# Altium schematic sheet Pull_test.SchDoc
size A3; Date: 2019年10月4日; Author: XJJ; DrawnBy: XJJ; Engineer: XJJ
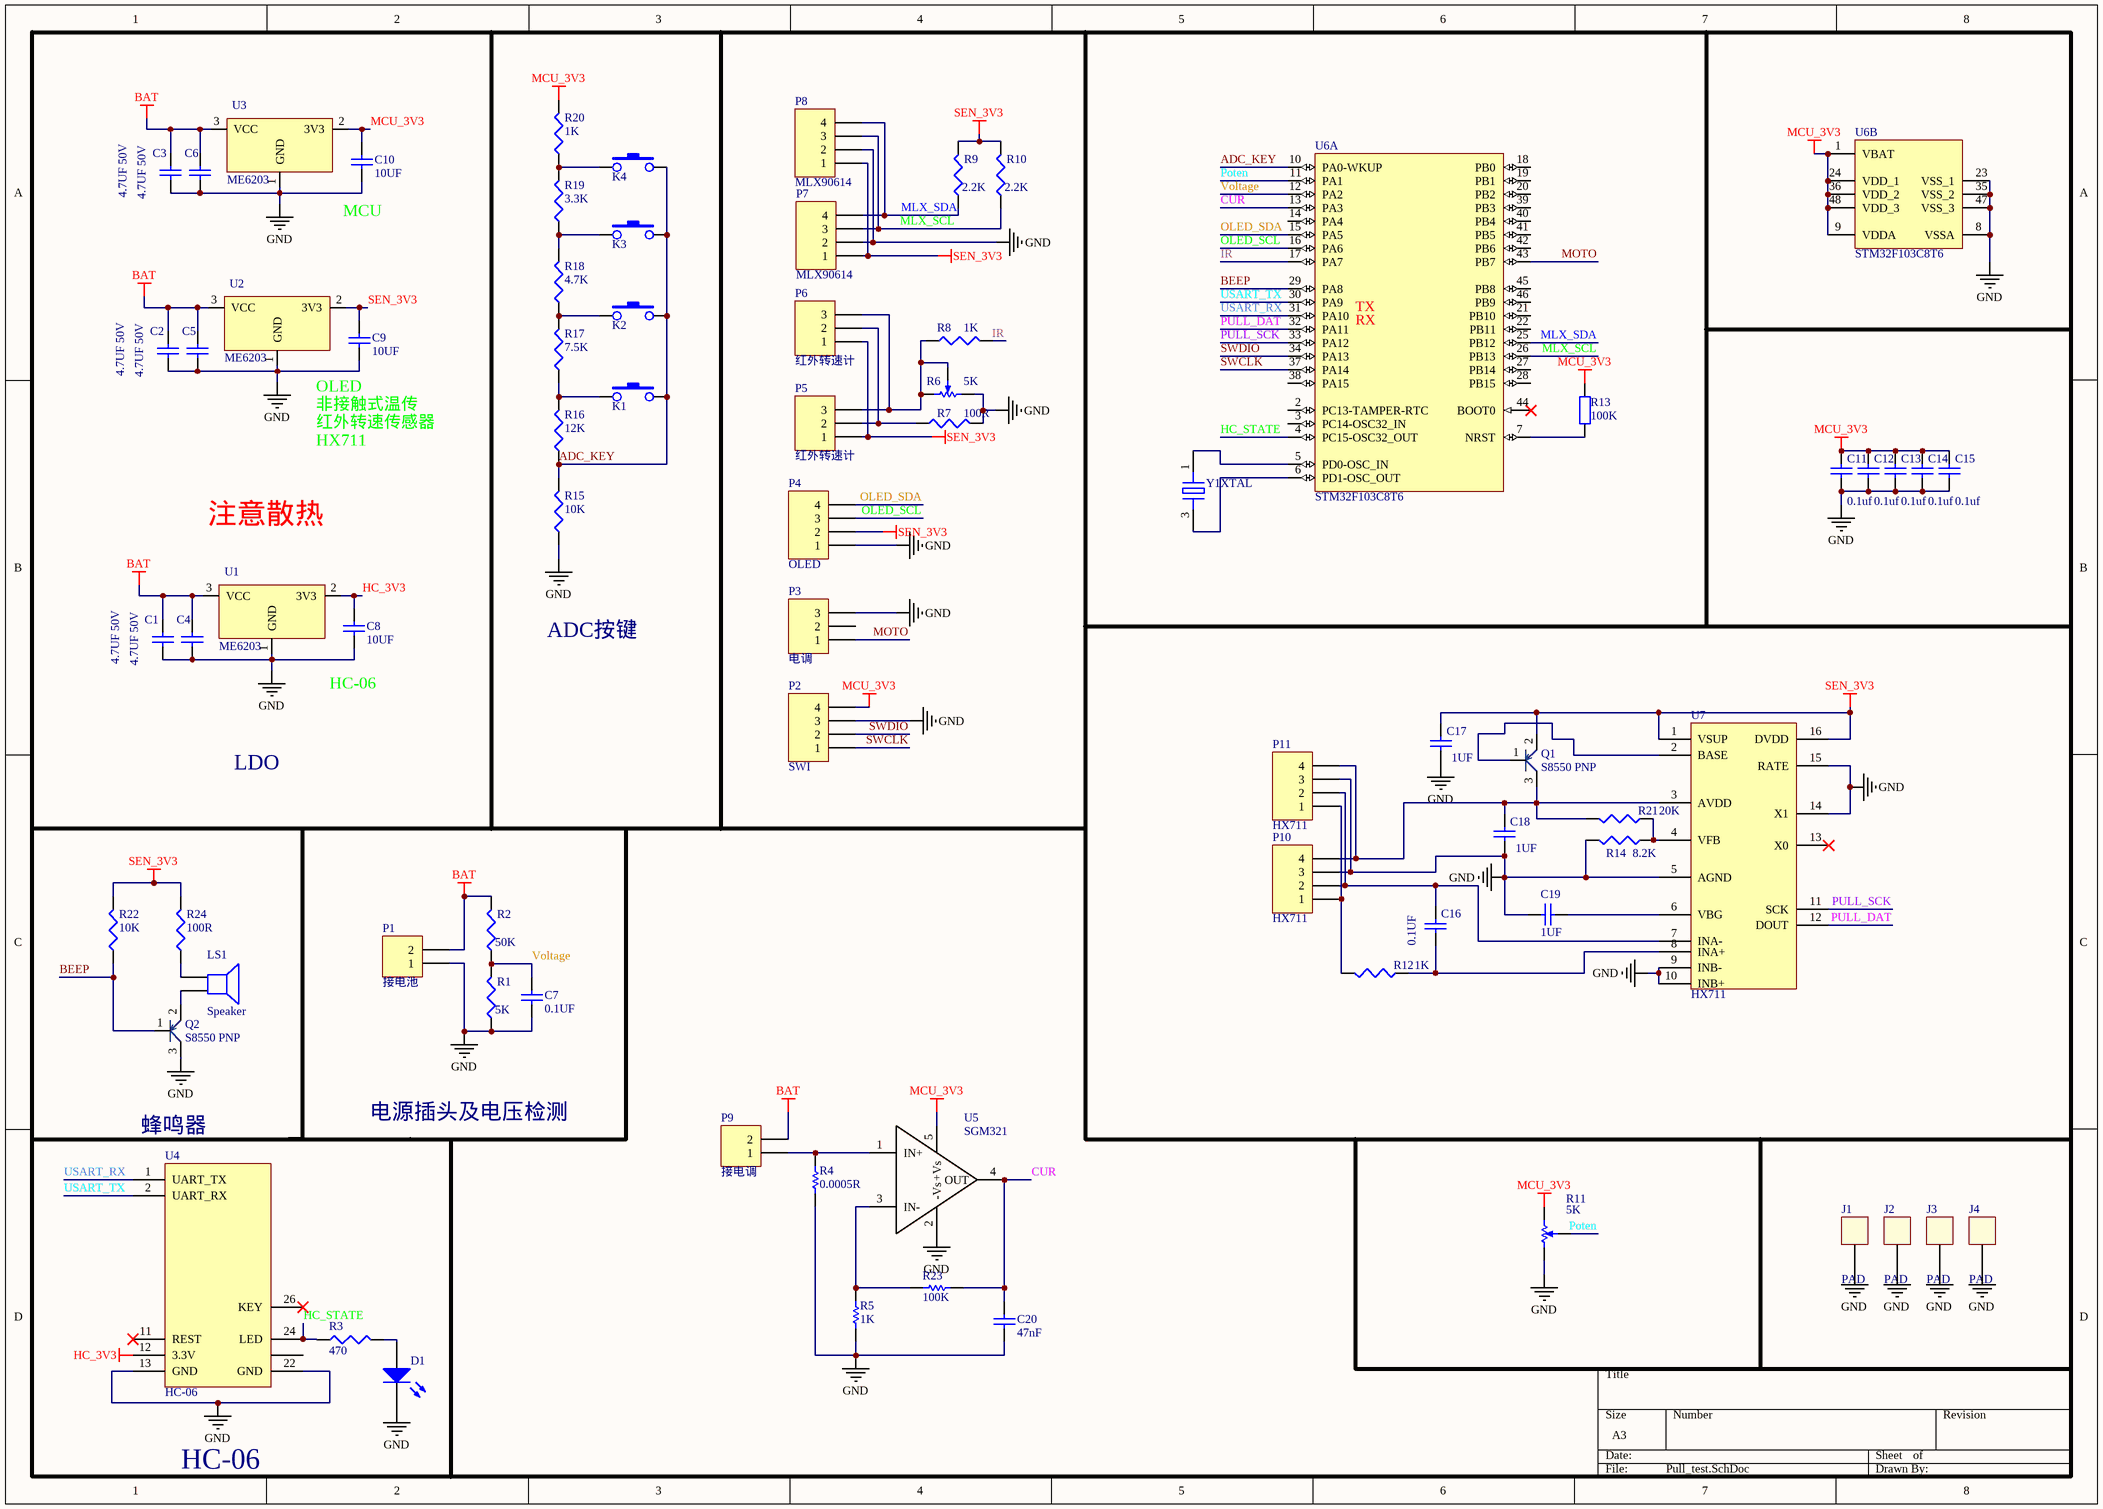
[diagram p0: Pull_test.SchDoc]

## Parts
C1  4.7UF 50V  [0805C]
C2  4.7UF 50V  [0805C]
C3  4.7UF 50V  [0805C]
C4  4.7UF 50V  [0805C]
C5  4.7UF 50V  [0805C]
C6  4.7UF 50V  [0805C]
C7  0.1UF  [0603]
C8  10UF  [0603]
C9  10UF  [0603]
C10  10UF  [0603]
C11  0.1uf  [0603]
C12  0.1uf  [0603]
C13  0.1uf  [0603]
C14  0.1uf  [0603]
C15  0.1uf  [0603]
C16  0.1UF  [0603]
C17  1UF  [0603]
C18  1UF  [0603]
C19  1UF  [0603]
C20  47nF  [0603]
D1  LED2  [0603D]  (value not drawn)
J1  PAD  [PAD]
J2  PAD  [PAD]
J3  PAD  [PAD]
J4  PAD  [PAD]
K1  BUTTON  [金属轻触开关]  (value not drawn)
K2  BUTTON  [金属轻触开关]  (value not drawn)
K3  BUTTON  [金属轻触开关]  (value not drawn)
K4  BUTTON  [金属轻触开关]  (value not drawn)
LS1  Speaker  [0905蜂鸣器]
P1  接电池  [XT60-90]
P2  SWI  [HDR1X4]
P3  电调  [HDR1X3]
P4  OLED  [HDR1X4]
P5  红外转速计  [1.25弯针-3p]
P6  红外转速计  [XH2.54-3P]
P7  MLX90614  [1.25弯针-4p]
P8  MLX90614  [XH2.54-4P]
P9  接电调  [XT60-90]
P10  HX711  [1.25弯针-4p]
P11  HX711  [XH2.54-4P]
Q1  S8550 PNP  [SOT23-3]
Q2  S8550 PNP  [SOT23-3]
R1  5K  [0603]
R2  50K  [0603]
R3  470  [0603]
R4  0.0005R  [2725-RES]
R5  1K  [0603]
R6  5K  [可调精密电阻]
R7  100R  [0603]
R8  1K  [0603]
R9  2.2K  [0603]
R10  2.2K  [0603]
R11  5K  [0932立式电位器]
R12  1K  [0603]
R13  100K  [0603]
R14  8.2K  [0603]
R15  10K  [0603]
R16  12K  [0603]
R17  7.5K  [0603]
R18  4.7K  [0603]
R19  3.3K  [0603]
R20  1K  [0603]
R21  20K  [0603]
R22  10K  [0603]
R23  100K  [0603]
R24  100R  [0603]
U1  ME6203  [SOT-23]
U2  ME6203  [SOT-23]
U3  ME6203  [SOT-23]
U4  HC-06  [HC06/HC05]
U5  SGM321  [SOT23-5]
U6  STM32F103C8T6  [STM-LQFP48_N]  (parts A,B of 2)
U7  HX711  [SOP-16]
Y1  XTAL  [5032晶振]

## Nets
BAT: C1.2 C2.2 C3.2 C4.2 C5.2 C6.2 P1.2 P9.2 R2.2 U1.3(VCC) U2.3(VCC) U3.3(VCC)
GND: C1.1 C2.1 C3.1 C4.1 C5.1 C6.1 C7.2 C8.1 C9.1 C10.1 C11.2 C12.2 C13.2 C14.2 C15.2 C17.2 C18.2 C19.1 C20.2 D1.2(K) J1.1 J2.1 J3.1 J4.1 P1.1 P2.3 P3.3 P4.1 P7.2 P8.2 P10.3 P11.3 Q2.3(C) R1.1 R4.2 R5.2 R6.CCW(-) R7.2 R11.CCW(-) R14.2 R15.1 U1.1(GND) U2.1(GND) U3.1(GND) U4.13(GND) U4.22(GND) U5.2(-Vs) U6.8(VSSA) U6.23(VSS_1) U6.35(VSS_2) U6.47(VSS_3) U7.5(AGND) U7.9(INB-) U7.10(INB+) U7.14(X1) U7.15(RATE)
HC_3V3: C8.2 U1.2(3V3) U4.12(3.3V)
MCU_3V3: C10.2 C11.1 C12.1 C13.1 C14.1 C15.1 P2.4 R11.CW(+) R13.2 R20.2 U3.2(3V3) U5.5(+Vs) U6.1(VBAT) U6.9(VDDA) U6.24(VDD_1) U6.36(VDD_2) U6.48(VDD_3)
SEN_3V3: C9.2 C17.1 P4.2 P5.1 P6.1 P7.1 P8.1 Q1.2(E) R9.2 R10.2 R22.2 R24.2 U2.2(3V3) U7.1(VSUP) U7.16(DVDD)
ADC_KEY: K1.2 K2.2 K3.2 K4.2 R15.2 R16.1 U6.10(PA0-WKUP)
BEEP: Q2.1(B) R22.1 U6.29(PA8)
CUR: C20.1 R23.2 U5.4(OUT) U6.13(PA3)
HC_STATE: R3.1 U4.24(LED) U6.4(PC15-OSC32_OUT)
IR: R8.2 U6.17(PA7)
MLX_SCL: P7.3 P8.3 R10.1 U6.26(PB13)
MLX_SDA: P7.4 P8.4 R9.1 U6.25(PB12)
MOTO: P3.1 U6.43(PB7)
OLED_SCL: P4.3 U6.16(PA6)
OLED_SDA: P4.4 U6.15(PA5)
Poten: R11.W U6.11(PA1)
PULL_DAT: U6.32(PA11) U7.12(DOUT)
PULL_SCK: U6.33(PA12) U7.11(SCK)
SWCLK: P2.1 U6.37(PA14)
SWDIO: P2.2 U6.34(PA13)
USART_RX: U4.1(UART_TX) U6.31(PA10)
USART_TX: U4.2(UART_RX) U6.30(PA9)
Voltage: C7.1 R1.2 R2.1 U6.12(PA2)
NetC16_1: C16.1 P10.2 P11.2 U7.7(INA-)
NetC16_2: C16.2 R12.1 U7.8(INA+)
NetC18_1: C18.1 P10.4 P11.4 Q1.3(C) R21.2 U7.3(AVDD)
NetC19_2: C19.2 U7.6(VBG)
NetD1_1: D1.1(A) R3.2
NetK1_1: K1.1 R16.2 R17.1
NetK2_1: K2.1 R17.2 R18.1
NetK3_1: K3.1 R18.2 R19.1
NetK4_1: K4.1 R19.2 R20.1
NetLS1_1: LS1.1 R24.1
NetLS1_2: LS1.2 Q2.2(E)
NetP5_2: P5.2 P6.2 R7.1
NetP5_3: P5.3 P6.3 R6.CW(+) R6.W R8.1
NetP9_1: P9.1 R4.1 U5.1(IN+)
NetP10_1: P10.1 P11.1 R12.2
NetQ1_1: Q1.1(B) U7.2(BASE)
NetR5_1: R5.1 R23.1 U5.3(IN-)
NetR13_1: R13.1 U6.7(NRST)
NetR14_1: R14.1 R21.1 U7.4(VFB)
NetU6_5: U6.5(PD0-OSC_IN) Y1.1
NetU6_6: U6.6(PD1-OSC_OUT) Y1.3

Not connected (* = marked no-connect by the designer): P3 2; U4 3(NC) 4(NC) 5(NC) 6(NC) 7(NC) 8(NC) 9(NC) 10(NC) 11(REST)* 14(NC) 15(NC) 16(NC) 17(NC) 18(NC) 19(NC) 20(NC) 21(GND) 23(NC) 25(NC) 26(KEY)* 27(NC) 28(NC) 29(NC) 30(NC) 31(NC) 32(NC) 33(NC) 34(NC); U6 2(PC13-TAMPER-RTC) 3(PC14-OSC32_IN) 14(PA4) 18(PB0) 19(PB1) 20(PB2) 21(PB10) 22(PB11) 27(PB14) 28(PB15) 38(PA15) 39(PB3) 40(PB4) 41(PB5) 42(PB6) 44(BOOT0)* 45(PB8) 46(PB9); U7 13(X0)*; Y1 2 4

## Notes on the sheet
- MCU
- (near U6) TX
- (near U6) RX
- 红外转速传感器
- HX711
- 非接触式温传
- OLED
- 注意散热
- ADC按键
- HC-06
- LDO
- 电源插头及电压检测
- (near U4) 蜂鸣器

## Library data of the parts
C1-C6 = Cap: 0805 50v 4.7uf; Published: 8-Jun-2000; LatestRevisionDate: 17-Jul-2002; LatestRevisionNote: Re-released for DXP Platform.; PackageReference: RAD-0.3; Publisher: Altium Limited; PackageDescription: Radial Cap, Thru-Hole; 2 Leads; 0.3 in Pin Spacing
C7 C11-C19 = Cap: 电容; Published: 8-Jun-2000; LatestRevisionDate: 17-Jul-2002; LatestRevisionNote: Re-released for DXP Platform.; PackageReference: RAD-0.3; Publisher: Altium Limited; PackageDescription: Radial Cap, Thru-Hole; 2 Leads; 0.3 in Pin Spacing
C8-C10 = Cap: Capacitor; Published: 8-Jun-2000; LatestRevisionDate: 17-Jul-2002; LatestRevisionNote: Re-released for DXP Platform.; PackageReference: RAD-0.3; Publisher: Altium Limited; PackageDescription: Radial Cap, Thru-Hole; 2 Leads; 0.3 in Pin Spacing
C20 = Cap: 输出滤波电容; Published: 8-Jun-2000; LatestRevisionDate: 17-Jul-2002; LatestRevisionNote: Re-released for DXP Platform.; PackageReference: RAD-0.3; Publisher: Altium Limited; PackageDescription: Radial Cap, Thru-Hole; 2 Leads; 0.3 in Pin Spacing
D1 = LED2: Typical RED, GREEN, YELLOW, AMBER GaAs LED; Published: 8-Jun-2000; LatestRevisionDate: 17-Jul-2002; LatestRevisionNote: Re-released for DXP Platform.; PackageVersion: Feb-2002; PackageReference: 3.2X1.6X1.1; Publisher: Altium Limited; PackageDescription: SM LED; 2 Flat Leads
LS1 = Speaker: Loudspeaker; Published: 24-Mar-1999; LatestRevisionDate: 17-Jul-2002; LatestRevisionNote: Re-released for DXP Platform.; PackageReference: PIN2; Publisher: Altium Limited
P1 = Header 2: Header, 2-Pin; pin to pad: 1>2 2>1; LatestRevisionDate: 17-Jul-2002; LatestRevisionNote: Re-released for DXP Platform.; Publisher: Altium Limited
P2 P4 P7 P8 P10 P11 = Header 4: Header, 4-Pin; LatestRevisionDate: 17-Jul-2002; LatestRevisionNote: Re-released for DXP Platform.; Publisher: Altium Limited
P3 P5 P6 = Header 3: Header, 3-Pin; LatestRevisionDate: 17-Jul-2002; LatestRevisionNote: Re-released for DXP Platform.; Publisher: Altium Limited
P9 = Header 2: Header, 2-Pin; LatestRevisionDate: 17-Jul-2002; LatestRevisionNote: Re-released for DXP Platform.; Publisher: Altium Limited
Q1 = S8550 PNP: M6
R1-R3 R7-R10 R12 R14 R16-R21 R24 = Res3: Resistor; Value: 10K; Published: 8-Jun-2000; LatestRevisionDate: 29-May-2009; LatestRevisionNote: IPC-7351 Footprint Added.; PackageReference: J1-0603; Publisher: Altium Limited; PackageDescription: Chip Resistor
R4 R23 = Res Semi: Semiconductor Resistor; Value: 1K; Published: 8-Jun-2000; LatestRevisionDate: 17-Jul-2002; LatestRevisionNote: Re-released for DXP Platform.; PackageReference: AXIAL-0.5; Publisher: Altium Limited; PackageDescription: Axial Device, Thru-Hole; 2 Leads; 0.5 in Pin Spacing
R5 = Res Semi: Semiconductor Resistor; Published: 8-Jun-2000; LatestRevisionDate: 17-Jul-2002; LatestRevisionNote: Re-released for DXP Platform.; PackageReference: AXIAL-0.5; Publisher: Altium Limited; PackageDescription: Axial Device, Thru-Hole; 2 Leads; 0.5 in Pin Spacing; Value: 1K
R6 = RPot SM: 立式圆轴梅花柄; pin to pad: CCW>1 CW>2 W>3; Published: 17-Dec-2003; DatasheetVersion: Oct-2003; PackageReference: POT4MM-2; Publisher: Altium Limited; PackageDescription: Square Trimming Potentiometer; ComponentLink1Description: Manufacturer Link; ComponentLink1URL: http://bourns.com/2/search.html
R11 = RPot SM: 立式圆轴梅花柄; pin to pad: CCW>1 CW>3 W>2; Published: 17-Dec-2003; DatasheetVersion: Oct-2003; PackageReference: POT4MM-2; Publisher: Altium Limited; PackageDescription: Square Trimming Potentiometer; ComponentLink1Description: Manufacturer Link; ComponentLink1URL: http://bourns.com/2/search.html
R13 = Res2: Resistor; Published: 8-Jun-2000; LatestRevisionDate: 17-Jul-2002; LatestRevisionNote: Re-released for DXP Platform.; PackageReference: AXIAL-0.4; Publisher: Altium Limited; PackageDescription: Axial Device, Thru-Hole; 2 Leads; 0.4 in Pin Spacing
R15 R22 = Res3: Resistor; Published: 8-Jun-2000; LatestRevisionDate: 29-May-2009; LatestRevisionNote: IPC-7351 Footprint Added.; PackageReference: J1-0603; Publisher: Altium Limited; PackageDescription: Chip Resistor; Value: 10K
U1-U3 = ME6203: 3.3-40v供电范围，100ma负载能力; ComponentLink1Description: DATASHEET; ComponentLink1URL: E:\芯片资料\LOD\ME6203_CMOS低压差稳压
U5 = SGM321: 1MHz,6I0uA,Rail-to-Rail I/O CMOS Operational Amplifiers
U6 = STM32F103C8T6: ARM Cortex-M3 32-bit MCU, 64 KB Flash, 20 KB Internal RAM, 37 I/Os, 48-pin LQFP, -40 to 85 degC, Tray; A/D Converter: 2x12-bit (10 Channel); FLASH Size (Prog) (kB): 64; I/Os (High Current): 37; Internal RAM Size (kB): 20; Operating Frequency(F) (Processor speed) (MHz): 72; Supply Voltage(Vcc) min (V): 2; DatasheetVersion: Rev. 16; PackageVersion: Rev. 6, 06/2013; PackageReference: LQFP48; PackageDescription: 48-Pin Low Profile Quad Flat Package, 7 x 7 mm Body, 0.5 mm Pitch; Supplier 1: Digi-Key; Supplier Part Number 1: 497-6063-ND; Supplier 2: Farnell; Supplier Part Number 2: 1447637; Supplier 3: Newark; Supplier Part Number 3: 59M2182; Supplier 4: Newark; Supplier Part Number 4: 57P1222; Supplier 5: Mouser; Supplier Part Number 5: 511-STM32F103C8T6; Core: ARM Cortex-M3; Packing: Tray; Mounting Technology: Surface Mount; PartNumber: STM32F103C8T6; ComponentLink1Description: Manufacturer URL; ComponentLink1URL: http://www.st.com/web/en/home.html; ComponentLink2Description: Datasheet; ComponentLink2URL: http://www.st.com/st-web-ui/static/active/en/resource/technical/document/datasheet/CD00161566.pdf; ComponentLink3Description: Package Specification; ComponentLink3URL: http://www.st.com/st-web-ui/static/active/en/resource/technical/document/datasheet/DM00058181.pdf
U7 = HX711电子秤: HX711电子秤放大器
Y1 = 5032晶振